# Altium project PuttPilot-Dev.PrjPcb (part 1 of 4)
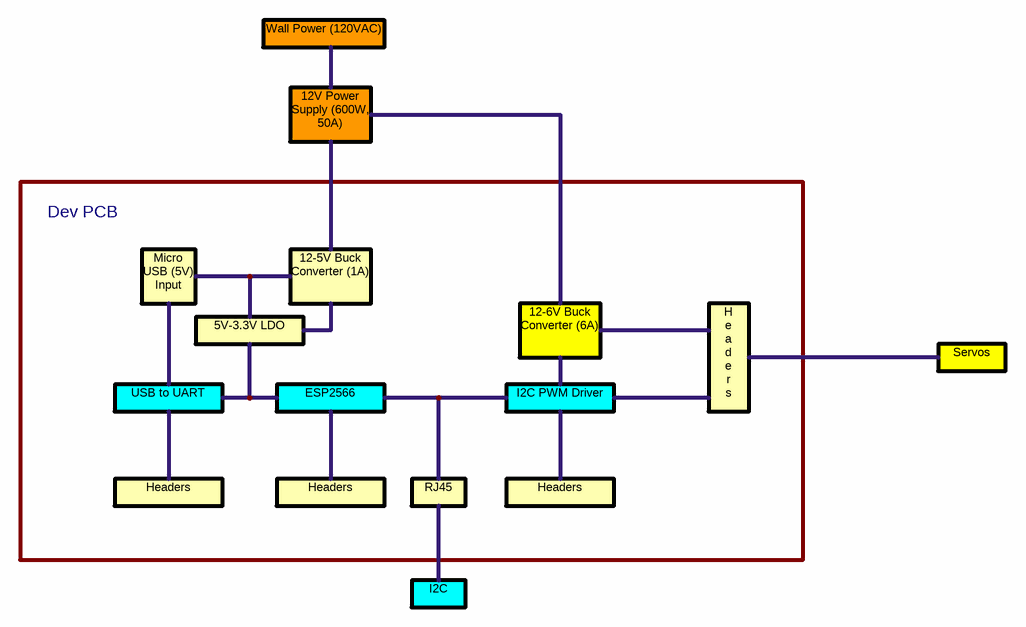
[diagram p0: Block-Diagram.SchDoc]
7 sheets, 253 parts. Net scope: hierarchical (ports join the sheet entries above them; power ports are global).
Board file: PuttPilot-Dev.PcbDoc
Sheets:
  Block-Diagram.SchDoc
  Hierarchal.SchDoc
    U_PWM_CONTROL = PWM_CONTROL.SchDoc
    U_ESP8266 = ESP8266.SchDoc
    U_ESP-Power = ESP-Power.SchDoc
    U_UART_TO_UART = USB_TO_UART.SchDoc
    B1 = Servo-Power.SchDoc
    B2 = Servo-Power.SchDoc
    B3 = Servo-Power.SchDoc

## Sheet Block-Diagram.SchDoc: Block Diagram
size 279 x 215 mm; DrawnBy: Ethan Abraham; Engineer: Ethan Abraham; Revision: 1.0; SheetNumber: 1; SheetTotal: 7

### Notes on the sheet
- Wall Power (120VAC)
- 12V Power Supply (600W, 50A)
- Dev PCB
- Micro USB (5V) Input
- 12-5V Buck Converter (1A)
- 5V-3.3V LDO
- 12-6V Buck Converter (6A)
- Servos
- USB to UART
- ESP2566
- I2C PWM Driver
- H
  e
  a
  d
  e
  r
  s
- Headers
- RJ45
- I2C
- PuttPilot
- 200 University Ave W
- PROJECT
- Waterloo, Ontario, Canada
- N2L 3G1
- REVISION
- DOCUMENT
- ENGINEER
- REVIEWER
- MODIFIED
- SHEET
- OF

## Sheet Hierarchal.SchDoc: Hierarchal Power
size 431 x 279 mm; DrawnBy: Ethan Abraham; Engineer: Ethan Abraham; SheetNumber: 2; SheetTotal: 7
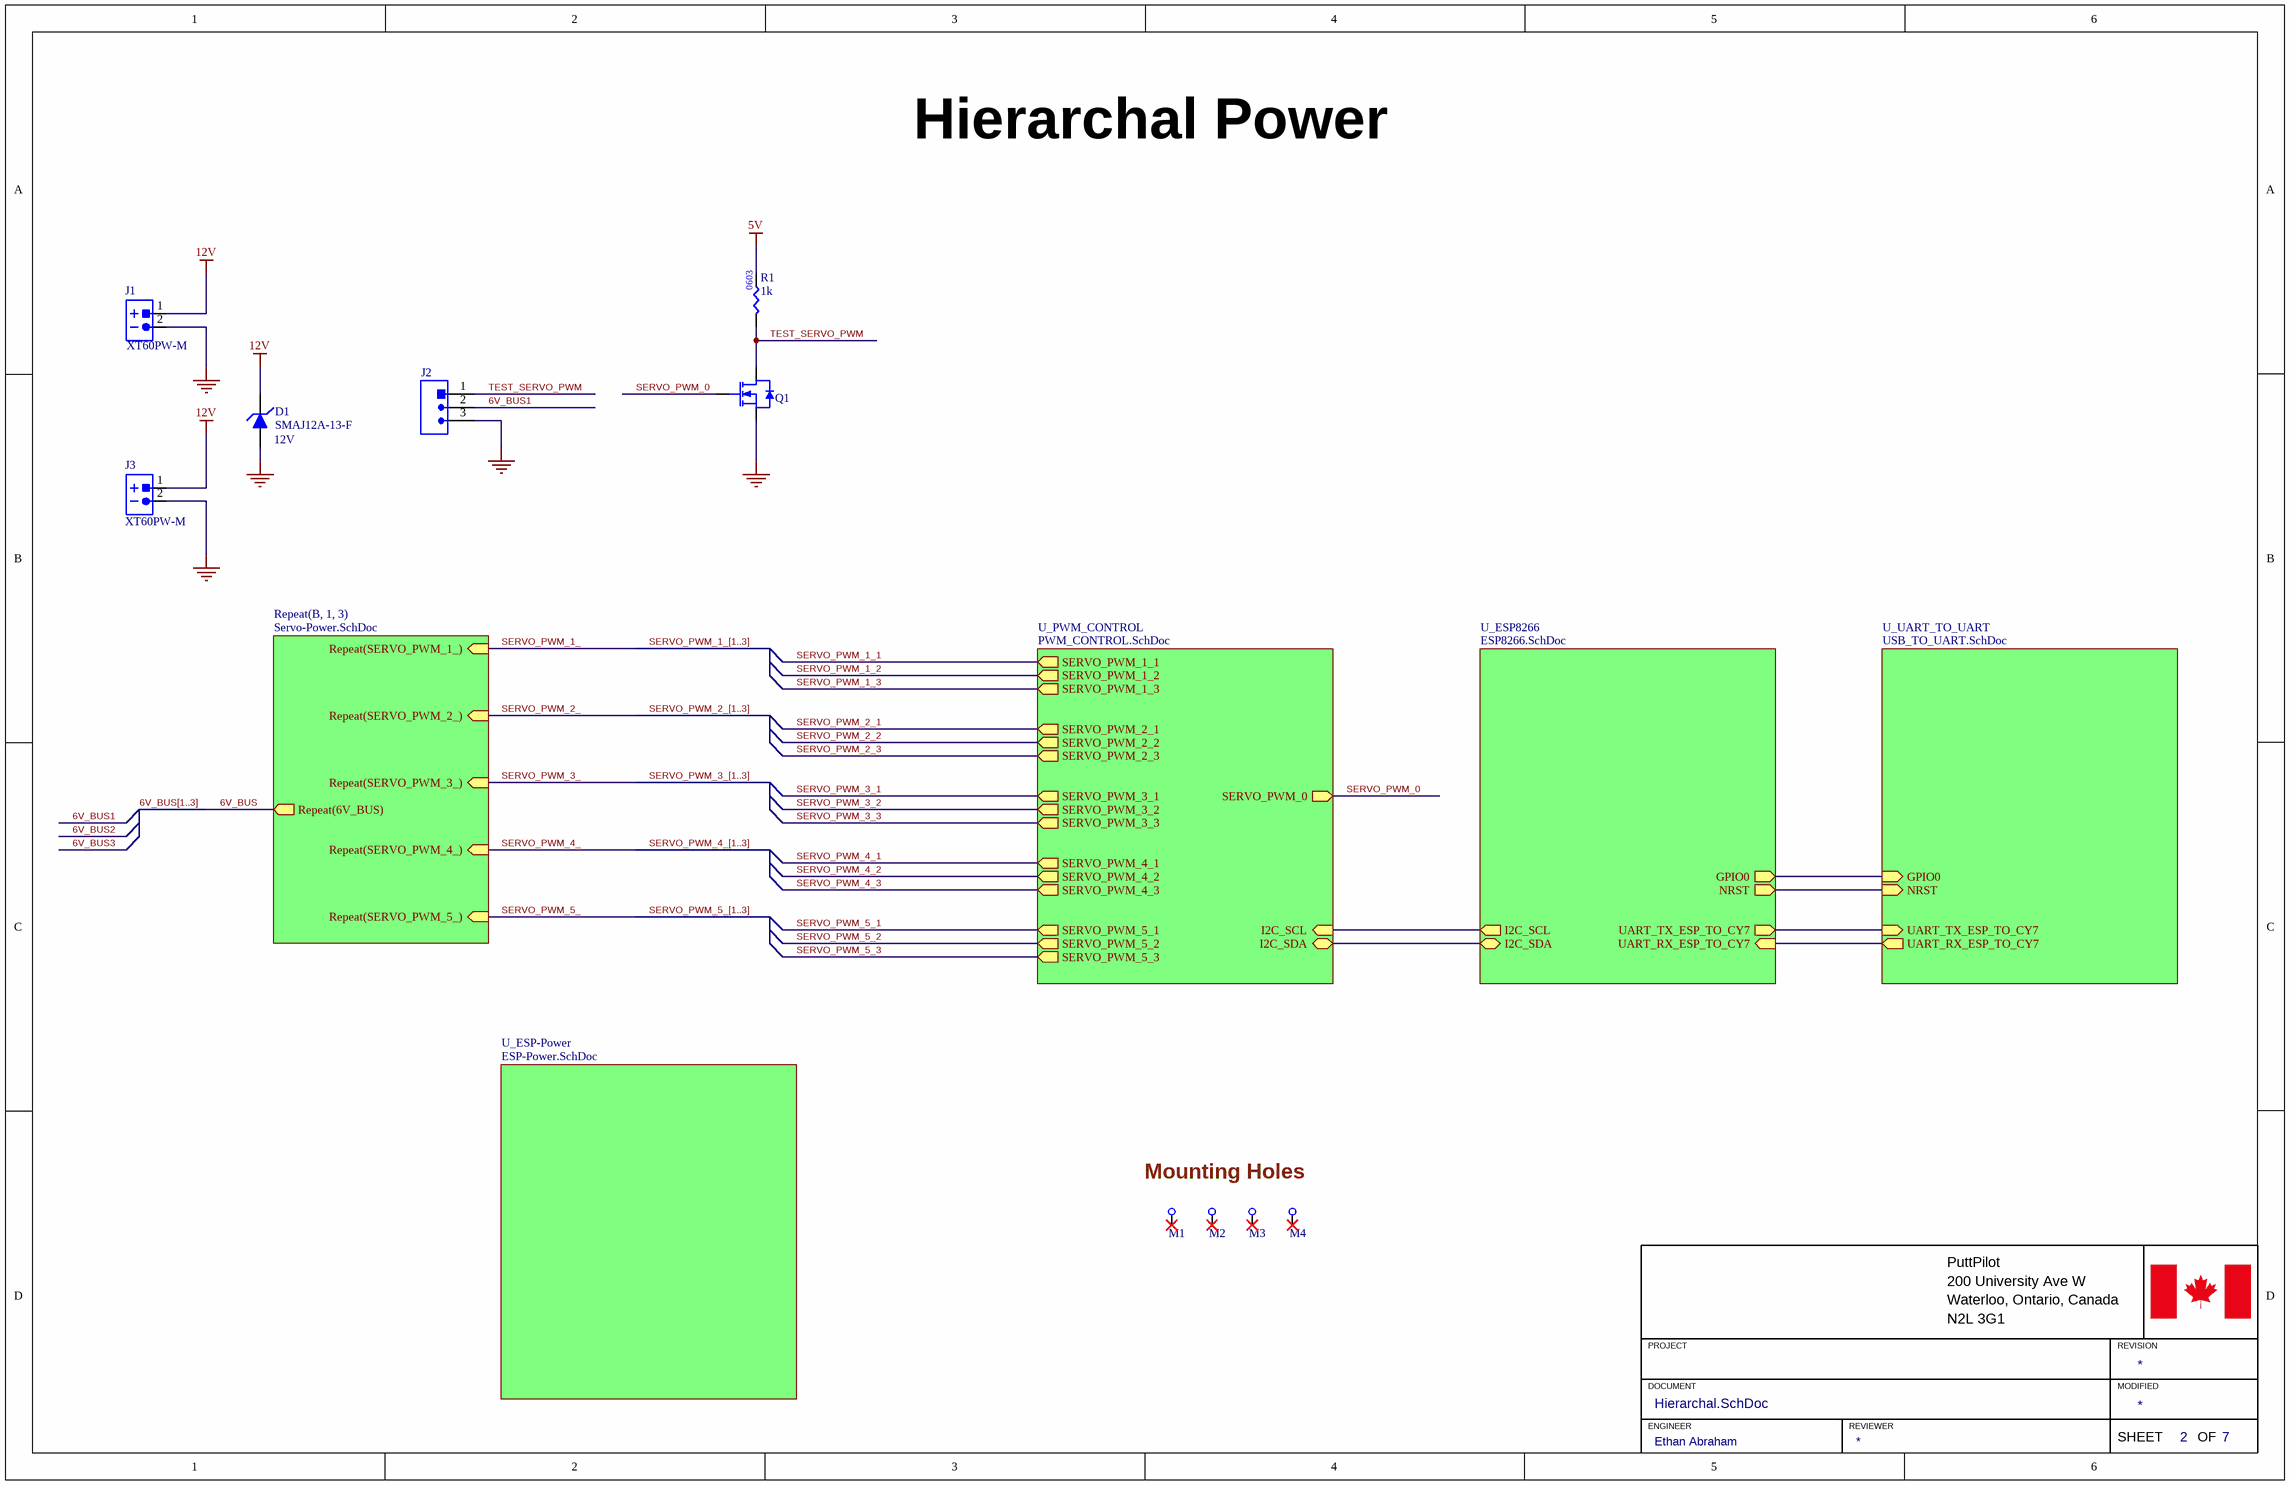
[diagram p1: Hierarchal.SchDoc]

### Parts
D1  SMAJ12A-13-F  Rep Pk Reverse Voltage-Max: 12V  [SMAJ12A-13-F]
J1  XT60PW-M  [XT60PW-M]
J2  TSW-101-08-G-T-RA  [HEADER_3POS_R/A_2.54MM]  (value not drawn)
J3  XT60PW-M  [XT60PW-M]
M1  .HOLE_M3  [.HOLE_M3]  (value not drawn)
M2  .HOLE_M3  [.HOLE_M3]  (value not drawn)
M3  .HOLE_M3  [.HOLE_M3]  (value not drawn)
M4  .HOLE_M3  [.HOLE_M3]  (value not drawn)
Q1  DMN6140L-7  [.SOT-23-3]  (value not drawn)
R1  Resistance: 1k  [.RES_0603]  (hidden comment: RC0603FR-071KL)

### Sub-sheets
Repeat(B, 1, 3) = Servo-Power.SchDoc: Repeat(6V_BUS) (out), Repeat(SERVO_PWM_1_) (in), Repeat(SERVO_PWM_2_) (in), Repeat(SERVO_PWM_3_) (in), Repeat(SERVO_PWM_4_) (in), Repeat(SERVO_PWM_5_) (in)
U_ESP8266 = ESP8266.SchDoc: I2C_SDA (bidir), I2C_SCL (out), UART_TX_ESP_TO_CY7 (out), UART_RX_ESP_TO_CY7 (in), GPIO0 (out), NRST (out)
U_ESP-Power = ESP-Power.SchDoc: no entries
U_PWM_CONTROL = PWM_CONTROL.SchDoc: SERVO_PWM_0 (out), I2C_SCL (in), I2C_SDA (bidir), SERVO_PWM_1_1 (out), SERVO_PWM_2_1 (out), SERVO_PWM_3_1 (out), SERVO_PWM_4_1 (out), SERVO_PWM_5_1 (out), SERVO_PWM_1_2 (out), SERVO_PWM_2_2 (out), SERVO_PWM_3_2 (out), SERVO_PWM_4_2 (out), SERVO_PWM_5_2 (out), SERVO_PWM_1_3 (out), SERVO_PWM_2_3 (out), SERVO_PWM_3_3 (out), SERVO_PWM_4_3 (out), SERVO_PWM_5_3 (out)
U_UART_TO_UART = USB_TO_UART.SchDoc: UART_RX_ESP_TO_CY7 (out), UART_TX_ESP_TO_CY7 (in), NRST (in), GPIO0 (in)

### Nets
5V: R1.2
12V: D1.2(Pin_2) J1.1 J3.1
GND: D1.1(Pin_1) J1.2 J2.3 J3.2 Q1.2(Source)
6V_BUS: sheet Repeat(B, 1, 3)/Repeat(6V_BUS)
6V_BUS1: J2.2  [project net 6V_BUS]
GPIO0: sheet U_ESP8266/GPIO0, sheet U_UART_TO_UART/GPIO0
I2C_SCL: sheet U_PWM_CONTROL/I2C_SCL, sheet U_ESP8266/I2C_SCL
I2C_SDA: sheet U_PWM_CONTROL/I2C_SDA, sheet U_ESP8266/I2C_SDA
NRST: sheet U_ESP8266/NRST, sheet U_UART_TO_UART/NRST
SERVO_PWM_0: Q1.1(Gate) ; sheet U_PWM_CONTROL/SERVO_PWM_0
SERVO_PWM_1_: sheet Repeat(B, 1, 3)/Repeat(SERVO_PWM_1_)
SERVO_PWM_2_: sheet Repeat(B, 1, 3)/Repeat(SERVO_PWM_2_)
SERVO_PWM_3_: sheet Repeat(B, 1, 3)/Repeat(SERVO_PWM_3_)
SERVO_PWM_4_: sheet Repeat(B, 1, 3)/Repeat(SERVO_PWM_4_)
SERVO_PWM_5_: sheet Repeat(B, 1, 3)/Repeat(SERVO_PWM_5_)
TEST_SERVO_PWM: J2.1 Q1.3(Drain) R1.1
UART_RX_ESP_TO_CY7: sheet U_ESP8266/UART_RX_ESP_TO_CY7, sheet U_UART_TO_UART/UART_RX_ESP_TO_CY7
UART_TX_ESP_TO_CY7: sheet U_ESP8266/UART_TX_ESP_TO_CY7, sheet U_UART_TO_UART/UART_TX_ESP_TO_CY7

Not connected (* = marked no-connect by the designer): M1 1*; M2 1*; M3 1*; M4 1*

### Buses and harness runs
bus 6V_BUS[1..3]
bus SERVO_PWM_1_[1..3]
bus SERVO_PWM_2_[1..3]
bus SERVO_PWM_3_[1..3]
bus SERVO_PWM_4_[1..3]
bus SERVO_PWM_5_[1..3]

### Notes on the sheet
- Mounting Holes
- PuttPilot
- 200 University Ave W
- Waterloo, Ontario, Canada
- PROJECT
- N2L 3G1
- REVISION
- DOCUMENT
- ENGINEER
- REVIEWER
- MODIFIED
- SHEET
- OF

### Library data of the parts
D1 = SMAJ12A-13-F: TVS DIODE 12VWM; Manufacturer: Diodes; Package Body Material: Plastic; Diode Element Material: SILICON; Diode Type: TRANS VOLTAGE SUPPRESSOR; Number of Elements: 1; Time @ Peak Reflow Temperature-Max (s): 40s; Polarity: Unidirectional; Additional Feature: EXCELLENT CLAMPING CAPABILITY; Max Breakdown Voltage: 14.7V; Min Breakdown Voltage: 13.3V; Breakdown Voltage-Nom: 14V; Clamping Voltage-Max: 19.9V; Non-rep Peak Rev Power Dis-Max: 400W; Max Power Dissipation: 1W; Qualification Status: Not Qualified; Supplier 1: Digikey; Manufacturer Part Number: SMAJ12A-13-F; RoHS: Yes; Category: TVS Diodes; Stock 1: 25706; Pricing 1: 1=0.29, 10=0.197, 100=0.1322, 500=0.1019, 1000=0.09178, 2000=0.08313 (USD); Number of Pins: 2; Package Shape: Rectangular; Terminal Finish: Tin; Min Operating Temperature: -55°C; Max Operating Temperature: 150°C; JESD-609 Code: e3; JESD-30 Code: R-PDSO-C2; Package Style: SMALL OUTLINEMeter; Surface Mount: Yes; Terminal Form: C BEND; Terminal Position: DUAL; Moisture Sensitivity Level: 1; Peak Reflow Temperature (Cel): 260°C; Technology: AVALANCHE; RoHS Compliant: Yes; Reach SVHC Compliant: No; ComponentLink1URL: https://datasheet.ciiva.com:443/pdfs/VipMasterIC/IC/DIOD/DIOD-S-A0009689838/DIOD-S-A0009691421-1.pdf?src-supplier=IHS+Markit; ComponentLink1Description: https://datasheet.ciiva.com:443/pdfs/VipMasterIC/IC/DIOD/DIOD-S-A0009689838/DIOD-S-A0009691421-1.pdf?src-supplier=IHS+Markit; ComponentLink2URL: https://datasheet.ciiva.com/15143/getdatasheetpartid-164236-15143864.pdf?src-supplier=Verical; ComponentLink2Description: https://datasheet.ciiva.com/15143/getdatasheetpartid-164236-15143864.pdf?src-supplier=Verical; Supplier Part Number 1: SMAJ12A-FDICT-ND
J1 J3 = XT60PW-M: XT60PW Male; Manufacturer: Unclassified; Manufacturer Part Number: XT60PW-M; Supplier Part Number 1: 1805375
J2 = TSW-101-08-G-T-RA: CONN HEADER R/A 3POS 2.54MM
M1-M4 = .HOLE_M3: .HOLE M3
Q1 = DMN6140L-7: MOSFET N-CH 60V 1.6A SOT-23; Manufacturer: Diodes; Rds On Max: 140mR; Input Capacitance: 315pF; Max Power Dissipation: 700mW; Threshold Voltage: 3V; Number of Channels: 1; Gate to Source Voltage (Vgs): 20V; Fall Time: 2.7ns; Rise Time: 3.6ns; Turn-Off Delay Time: 16.3ns; Turn-On Delay Time: 2.6ns; Polarity: N-CHANNEL; Supplier 1: Future Electronics; Manufacturer Part Number: DMN6140L-7; RoHS: Yes; Category: MOSFETs; Stock 1: 624000; Pricing 1: 3000=0.0489, 9000=0.047, 15000=0.0462, 45000=0.0445, 75000=0.043 (USD); Mount: Surface Mount; Case/Package: SOT-23; Number of Pins: 3; Weight: 0.000282oz; Min Operating Temperature: -55°C; Max Operating Temperature: 150°C; Package Quantity: 1; Packaging: Tape and Reel; Drain to Source Voltage (Vdss): 60V; Continuous Drain Current (ID): 1.6A; Drain to Source Resistance: 140mR; Series: -; Reach SVHC Compliant: No; Lead Free: Lead Free; RoHS Compliant: Yes; ComponentLink1URL: https://datasheet.ciiva.com/29747/dmn6140l-29747654.pdf?src-supplier=Digikey; ComponentLink1Description: https://datasheet.ciiva.com/29747/dmn6140l-29747654.pdf?src-supplier=Digikey; ComponentLink2URL: https://datasheet.ciiva.com/29747/dmn6140l-29747660.pdf?src-supplier=Digikey; ComponentLink2Description: https://datasheet.ciiva.com/29747/dmn6140l-29747660.pdf?src-supplier=Digikey; Supplier Part Number 1: 4046633
R1 = RC0603FR-071KL: RES 1K OHM 0603; Manufacturer: Yageo; Tolerance: 1%; Additional Feature: LASER TRIMMABLE; Rated Power Dissipation (P): 100mW; Rated Temperature: 70°C; Temperature Coefficient: 100ppm/°C; Working Voltage: 75V; Package Height: 0.45mm; Package Length: 1.6mm; Package Width: 0.8mm; Supplier 1: Future Electronics; Manufacturer Part Number: RC0603FR-071KL; RoHS: Yes; Category: Chip SMD Resistors; Stock 1: 12810000; Pricing 1: 5000=0.0026, 50000=0.0025, 150000=0.0024, 375000=0.0023, 1000000=0.0022 (USD); Mount: Surface Mount; Number of Pins: 2; Package Shape: Rectangular; Size Code: 0603; Terminal Finish: Nickel; Min Operating Temperature: -55°C; Max Operating Temperature: 155°C; JESD-609 Code: e3; Resistor Type: FIXED RESISTOR; Construction: Chip; Package Style: SMTMeter; Packaging: Tape and Reel; Technology: METAL GLAZE/THICK FILM; Termination: Wraparound; Reach SVHC Compliant: Yes; RoHS Compliant: Yes; ComponentLink1URL: https://datasheet.ciiva.com:443/pdfs/VipMasterIC/IC/YAGO/YAGO-S-A0008145938/YAGO-S-A0008145938-1.pdf?src-supplier=IHS+Markit; ComponentLink1Description: https://datasheet.ciiva.com:443/pdfs/VipMasterIC/IC/YAGO/YAGO-S-A0008145938/YAGO-S-A0008145938-1.pdf?src-supplier=IHS+Markit; ComponentLink2URL: https://datasheet.ciiva.com/11808/0900766b80f96399-11808081.pdf?src-supplier=Rs; ComponentLink2Description: https://datasheet.ciiva.com/11808/0900766b80f96399-11808081.pdf?src-supplier=Rs; ComponentLink3URL: https://datasheet.ciiva.com/8896/pyu-rc0603-51-rohs-l-4-8896106.pdf?src-supplier=Avnet; ComponentLink3Description: https://datasheet.ciiva.com/8896/pyu-rc0603-51-rohs-l-4-8896106.pdf?src-supplier=Avnet; ComponentLink4URL: https://datasheet.ciiva.com/7660/1868787-7660790.pdf?src-supplier=Element14; ComponentLink4Description: https://datasheet.ciiva.com/7660/1868787-7660790.pdf?src-supplier=Element14; ComponentLink5URL: https://datasheet.ciiva.com/7746/1738695-7746279.pdf?src-supplier=Element14; ComponentLink5Description: https://datasheet.ciiva.com/7746/1738695-7746279.pdf?src-supplier=Element14; ComponentLink6URL: https://datasheet.ciiva.com/7746/1686128-7746280.pdf?src-supplier=Element14; ComponentLink6Description: https://datasheet.ciiva.com/7746/1686128-7746280.pdf?src-supplier=Element14; ComponentLink7URL: https://datasheet.ciiva.com/7746/1738695-7746281.pdf?src-supplier=Element14; ComponentLink7Description: https://datasheet.ciiva.com/7746/1738695-7746281.pdf?src-supplier=Element14; ComponentLink8URL: https://datasheet.ciiva.com/7983/443971-7983613.pdf?src-supplier=Element14; ComponentLink8Description: https://datasheet.ciiva.com/7983/443971-7983613.pdf?src-supplier=Element14; ComponentLink9URL: https://datasheet.ciiva.com/15189/getdatasheetpartid-404327-15189644.pdf?src-supplier=Verical; ComponentLink9Description: https://datasheet.ciiva.com/15189/getdatasheetpartid-404327-15189644.pdf?src-supplier=Verical; Supplier Part Number 1: 4016291

## Sheet PWM_CONTROL.SchDoc: PWM Control
size 279 x 215 mm; DrawnBy: Ethan Abraham; Engineer: Ethan Abraham; Revision: 1.0; SheetNumber: 7; SheetTotal: 7
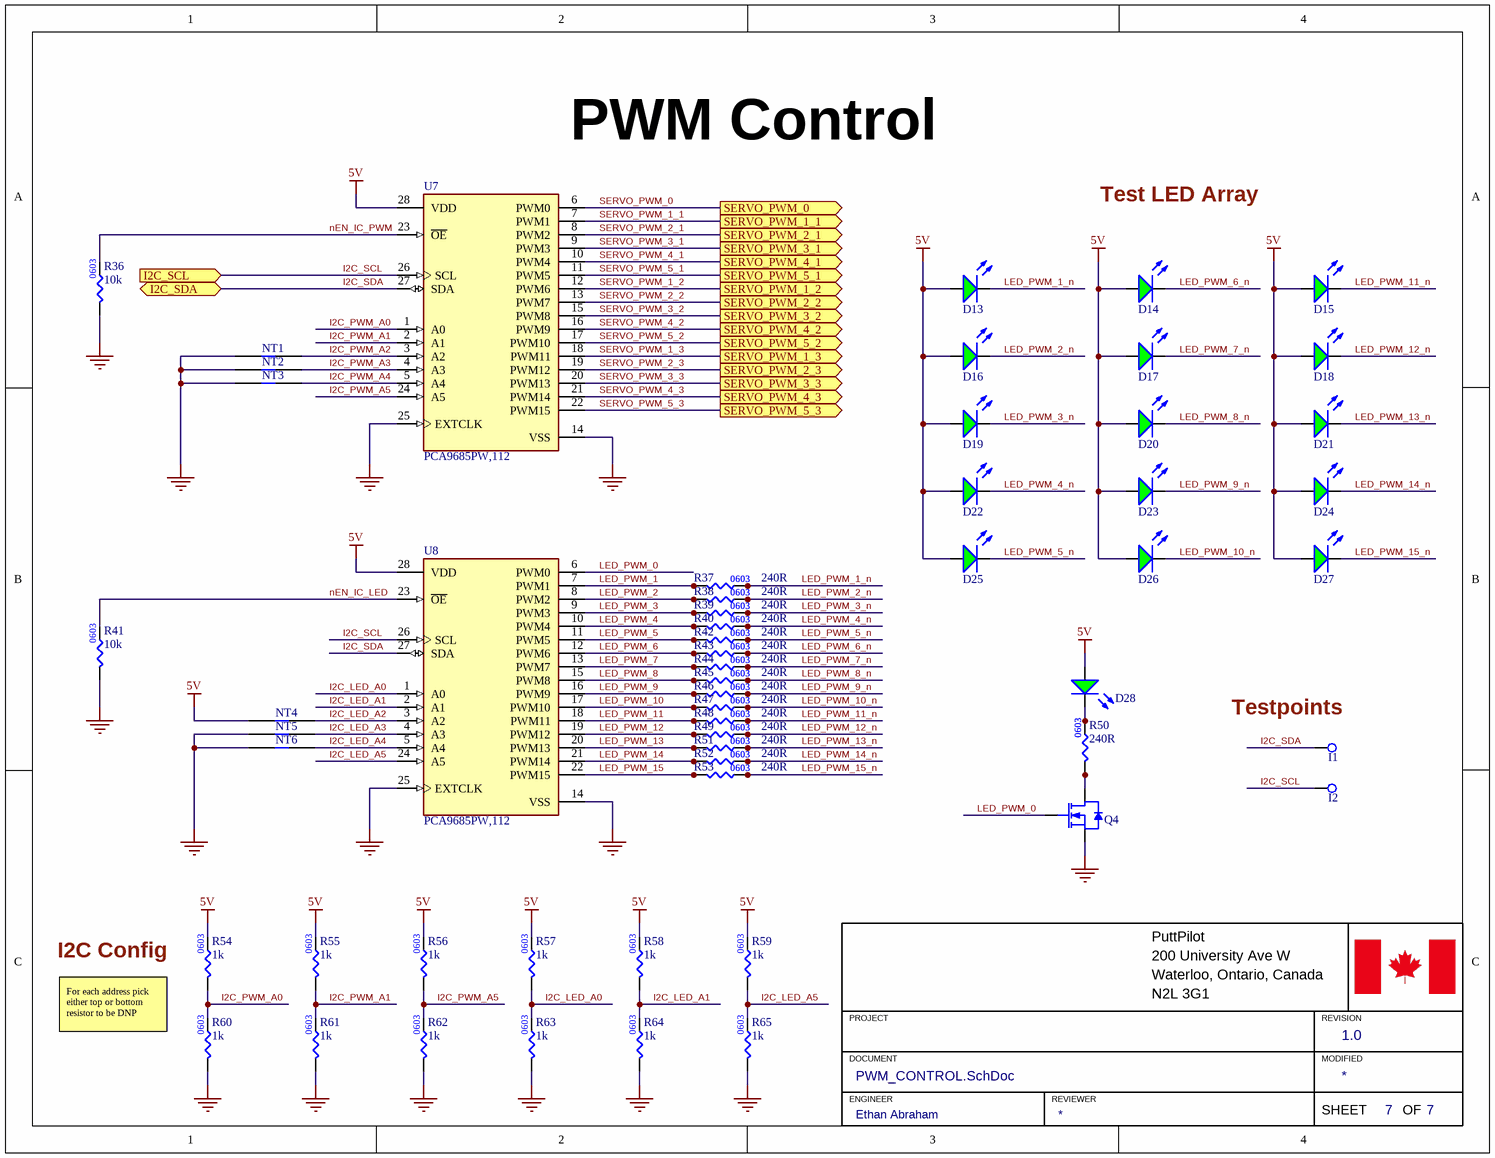
[diagram p2: PWM_CONTROL.SchDoc]

### Parts
D13  LTST-C191KGKT  [.LED_0603]  (value not drawn)
D14  LTST-C191KGKT  [.LED_0603]  (value not drawn)
D15  LTST-C191KGKT  [.LED_0603]  (value not drawn)
D16  LTST-C191KGKT  [.LED_0603]  (value not drawn)
D17  LTST-C191KGKT  [.LED_0603]  (value not drawn)
D18  LTST-C191KGKT  [.LED_0603]  (value not drawn)
D19  LTST-C191KGKT  [.LED_0603]  (value not drawn)
D20  LTST-C191KGKT  [.LED_0603]  (value not drawn)
D21  LTST-C191KGKT  [.LED_0603]  (value not drawn)
D22  LTST-C191KGKT  [.LED_0603]  (value not drawn)
D23  LTST-C191KGKT  [.LED_0603]  (value not drawn)
D24  LTST-C191KGKT  [.LED_0603]  (value not drawn)
D25  LTST-C191KGKT  [.LED_0603]  (value not drawn)
D26  LTST-C191KGKT  [.LED_0603]  (value not drawn)
D27  LTST-C191KGKT  [.LED_0603]  (value not drawn)
D28  LTST-C191KGKT  [.LED_0603]  (value not drawn)
I1  RCWCTE  [RCWCTE]  (value not drawn)
I2  RCWCTE  [RCWCTE]  (value not drawn)
NT1  .NET_TIE  [.NET_TIE]  (value not drawn)
NT2  .NET_TIE  [.NET_TIE]  (value not drawn)
NT3  .NET_TIE  [.NET_TIE]  (value not drawn)
NT4  .NET_TIE  [.NET_TIE]  (value not drawn)
NT5  .NET_TIE  [.NET_TIE]  (value not drawn)
NT6  .NET_TIE  [.NET_TIE]  (value not drawn)
Q4  DMN6140L-7  [.SOT-23-3]  (value not drawn)
R36  Resistance: 10k  [.RES_0603]  (hidden comment: RC0603FR-0710KL)
R37  Resistance: 240R  [.RES_0603]  (hidden comment: RC0603FR-07240RL)
R38  Resistance: 240R  [.RES_0603]  (hidden comment: RC0603FR-07240RL)
R39  Resistance: 240R  [.RES_0603]  (hidden comment: RC0603FR-07240RL)
R40  Resistance: 240R  [.RES_0603]  (hidden comment: RC0603FR-07240RL)
R41  Resistance: 10k  [.RES_0603]  (hidden comment: RC0603FR-0710KL)
R42  Resistance: 240R  [.RES_0603]  (hidden comment: RC0603FR-07240RL)
R43  Resistance: 240R  [.RES_0603]  (hidden comment: RC0603FR-07240RL)
R44  Resistance: 240R  [.RES_0603]  (hidden comment: RC0603FR-07240RL)
R45  Resistance: 240R  [.RES_0603]  (hidden comment: RC0603FR-07240RL)
R46  Resistance: 240R  [.RES_0603]  (hidden comment: RC0603FR-07240RL)
R47  Resistance: 240R  [.RES_0603]  (hidden comment: RC0603FR-07240RL)
R48  Resistance: 240R  [.RES_0603]  (hidden comment: RC0603FR-07240RL)
R49  Resistance: 240R  [.RES_0603]  (hidden comment: RC0603FR-07240RL)
R50  Resistance: 240R  [.RES_0603]  (hidden comment: RC0603FR-07240RL)
R51  Resistance: 240R  [.RES_0603]  (hidden comment: RC0603FR-07240RL)
R52  Resistance: 240R  [.RES_0603]  (hidden comment: RC0603FR-07240RL)
R53  Resistance: 240R  [.RES_0603]  (hidden comment: RC0603FR-07240RL)
R54  Resistance: 1k  [.RES_0603]  (hidden comment: RC0603FR-071KL)
R55  Resistance: 1k  [.RES_0603]  (hidden comment: RC0603FR-071KL)
R56  Resistance: 1k  [.RES_0603]  (hidden comment: RC0603FR-071KL)
R57  Resistance: 1k  [.RES_0603]  (hidden comment: RC0603FR-071KL)
R58  Resistance: 1k  [.RES_0603]  (hidden comment: RC0603FR-071KL)
R59  Resistance: 1k  [.RES_0603]  (hidden comment: RC0603FR-071KL)
R60  Resistance: 1k  [.RES_0603]  (hidden comment: RC0603FR-071KL)
R61  Resistance: 1k  [.RES_0603]  (hidden comment: RC0603FR-071KL)
R62  Resistance: 1k  [.RES_0603]  (hidden comment: RC0603FR-071KL)
R63  Resistance: 1k  [.RES_0603]  (hidden comment: RC0603FR-071KL)
R64  Resistance: 1k  [.RES_0603]  (hidden comment: RC0603FR-071KL)
R65  Resistance: 1k  [.RES_0603]  (hidden comment: RC0603FR-071KL)
U7  PCA9685PW,112  [PCA9685PW,112]
U8  PCA9685PW,112  [PCA9685PW,112]

### Ports
I2C_SCL (in), I2C_SDA (bidir), SERVO_PWM_0 (out), SERVO_PWM_1_1 (out), SERVO_PWM_1_2 (out), SERVO_PWM_1_3 (out), SERVO_PWM_2_1 (out), SERVO_PWM_2_2 (out), SERVO_PWM_2_3 (out), SERVO_PWM_3_1 (out), SERVO_PWM_3_2 (out), SERVO_PWM_3_3 (out), SERVO_PWM_4_1 (out), SERVO_PWM_4_2 (out), SERVO_PWM_4_3 (out), SERVO_PWM_5_1 (out), SERVO_PWM_5_2 (out), SERVO_PWM_5_3 (out)

### Nets
5V: D13.1(A) D14.1(A) D15.1(A) D16.1(A) D17.1(A) D18.1(A) D19.1(A) D20.1(A) D21.1(A) D22.1(A) D23.1(A) D24.1(A) D25.1(A) D26.1(A) D27.1(A) D28.1(A) NT4.1 R54.2 R55.2 R56.2 R57.2 R58.2 R59.2 U7.28(VDD) U8.28(VDD)
GND: NT1.1 NT2.1 NT3.1 NT5.1 NT6.1 Q4.2(Source) R36.1 R41.1 R60.1 R61.1 R62.1 R63.1 R64.1 R65.1 U7.14(VSS) U7.25(EXTCLK) U8.14(VSS) U8.25(EXTCLK)
I2C_LED_A0: R57.1 R63.2 U8.1(A0)
I2C_LED_A1: R58.1 R64.2 U8.2(A1)
I2C_LED_A2: NT4.2 U8.3(A2)
I2C_LED_A3: NT5.2 U8.4(A3)
I2C_LED_A4: NT6.2 U8.5(A4)
I2C_LED_A5: R59.1 R65.2 U8.24(A5)
I2C_PWM_A0: R54.1 R60.2 U7.1(A0)
I2C_PWM_A1: R55.1 R61.2 U7.2(A1)
I2C_PWM_A2: NT1.2 U7.3(A2)
I2C_PWM_A3: NT2.2 U7.4(A3)
I2C_PWM_A4: NT3.2 U7.5(A4)
I2C_PWM_A5: R56.1 R62.2 U7.24(A5)
I2C_SCL: I2.1 U7.26(SCL) U8.26(SCL) ; port I2C_SCL
I2C_SDA: I1.1 U7.27(SDA) U8.27(SDA) ; port I2C_SDA
LED_PWM_0: Q4.1(Gate) U8.6(PWM0)
LED_PWM_1: R37.1 U8.7(PWM1)
LED_PWM_1_n: D13.2(K) R37.2
LED_PWM_2: R38.1 U8.8(PWM2)
LED_PWM_2_n: D16.2(K) R38.2
LED_PWM_3: R39.1 U8.9(PWM3)
LED_PWM_3_n: D19.2(K) R39.2
LED_PWM_4: R40.1 U8.10(PWM4)
LED_PWM_4_n: D22.2(K) R40.2
LED_PWM_5: R42.1 U8.11(PWM5)
LED_PWM_5_n: D25.2(K) R42.2
LED_PWM_6: R43.1 U8.12(PWM6)
LED_PWM_6_n: D14.2(K) R43.2
LED_PWM_7: R44.1 U8.13(PWM7)
LED_PWM_7_n: D17.2(K) R44.2
LED_PWM_8: R45.1 U8.15(PWM8)
LED_PWM_8_n: D20.2(K) R45.2
LED_PWM_9: R46.1 U8.16(PWM9)
LED_PWM_9_n: D23.2(K) R46.2
LED_PWM_10: R47.1 U8.17(PWM10)
LED_PWM_10_n: D26.2(K) R47.2
LED_PWM_11: R48.1 U8.18(PWM11)
LED_PWM_11_n: D15.2(K) R48.2
LED_PWM_12: R49.1 U8.19(PWM12)
LED_PWM_12_n: D18.2(K) R49.2
LED_PWM_13: R51.1 U8.20(PWM13)
LED_PWM_13_n: D21.2(K) R51.2
LED_PWM_14: R52.1 U8.21(PWM14)
LED_PWM_14_n: D24.2(K) R52.2
LED_PWM_15: R53.1 U8.22(PWM15)
LED_PWM_15_n: D27.2(K) R53.2
nEN_IC_LED: R41.2 U8.23(~{OE})
nEN_IC_PWM: R36.2 U7.23(~{OE})
SERVO_PWM_0: U7.6(PWM0) ; port SERVO_PWM_0
SERVO_PWM_1_1: U7.7(PWM1) ; port SERVO_PWM_1_1  [project net SERVO_PWM_1_]
SERVO_PWM_1_2: U7.12(PWM6) ; port SERVO_PWM_1_2  [project net SERVO_PWM_1_]
SERVO_PWM_1_3: U7.18(PWM11) ; port SERVO_PWM_1_3  [project net SERVO_PWM_1_]
SERVO_PWM_2_1: U7.8(PWM2) ; port SERVO_PWM_2_1  [project net SERVO_PWM_2_]
SERVO_PWM_2_2: U7.13(PWM7) ; port SERVO_PWM_2_2  [project net SERVO_PWM_2_]
SERVO_PWM_2_3: U7.19(PWM12) ; port SERVO_PWM_2_3  [project net SERVO_PWM_2_]
SERVO_PWM_3_1: U7.9(PWM3) ; port SERVO_PWM_3_1  [project net SERVO_PWM_3_]
SERVO_PWM_3_2: U7.15(PWM8) ; port SERVO_PWM_3_2  [project net SERVO_PWM_3_]
SERVO_PWM_3_3: U7.20(PWM13) ; port SERVO_PWM_3_3  [project net SERVO_PWM_3_]
SERVO_PWM_4_1: U7.10(PWM4) ; port SERVO_PWM_4_1  [project net SERVO_PWM_4_]
SERVO_PWM_4_2: U7.16(PWM9) ; port SERVO_PWM_4_2  [project net SERVO_PWM_4_]
SERVO_PWM_4_3: U7.21(PWM14) ; port SERVO_PWM_4_3  [project net SERVO_PWM_4_]
SERVO_PWM_5_1: U7.11(PWM5) ; port SERVO_PWM_5_1  [project net SERVO_PWM_5_]
SERVO_PWM_5_2: U7.17(PWM10) ; port SERVO_PWM_5_2  [project net SERVO_PWM_5_]
SERVO_PWM_5_3: U7.22(PWM15) ; port SERVO_PWM_5_3  [project net SERVO_PWM_5_]
NetD28_2: D28.2(K) R50.2
NetQ4_3: Q4.3(Drain) R50.1

### Notes on the sheet
- Test LED Array
- (near I1) Testpoints
- (near R54) I2C Config
- For each address pick either top or bottom resistor to be DNP
- PuttPilot
- 200 University Ave W
- PROJECT
- Waterloo, Ontario, Canada
- N2L 3G1
- REVISION
- DOCUMENT
- ENGINEER
- REVIEWER
- MODIFIED
- SHEET
- OF

### Library data of the parts
D13-D28 = LTST-C191KGKT: LED GREEN 2V 0603; Manufacturer: Vishay Lite-On; Shape: Rectangular; Lens Style: WATER CLEAR; Forward Current-Max: 30mA; Luminous Intensity-Nom: 35mcd; Number of Functions: 1; Optoelectronic Device Type: SINGLE COLOR LED; Viewing Angle: 130°; Forward Voltage-Max: 2.4V; Reverse Voltage-Max: 5V; Overall Height: 0.55mm; Supplier 1: Digikey; Manufacturer Part Number: LTST-C191KGKT; RoHS: Yes; Stock 1: 171853; Pricing 1: 1=0.22, 10=0.121, 100=0.0721, 500=0.05324, 1000=0.04748, 2000=0.04278 (USD); Mount: Surface Mount; Number of Pins: 2; Color: Green; Color@wavelength: Green; Terminal Finish: Tin; Min Operating Temperature: -55°C; Max Operating Temperature: 85°C; Packaging: Tape and Reel; JESD-609 Code: e3; Size: 1.1mm; Terminal Pitch: 1.5mm; Reach SVHC Compliant: Yes; RoHS Compliant: Yes; ComponentLink1URL: https://datasheet.ciiva.com:443/pdfs/VipMasterIC/IC/LITE/LITE-S-A0003156116/LITE-S-A0003156116-1.pdf?src-supplier=IHS+Markit; ComponentLink1Description: https://datasheet.ciiva.com:443/pdfs/VipMasterIC/IC/LITE/LITE-S-A0003156116/LITE-S-A0003156116-1.pdf?src-supplier=IHS+Markit; ComponentLink2URL: https://datasheet.ciiva.com/2109/ltst-c191kgkt-2109973.pdf?src-supplier=Digikey; ComponentLink2Description: https://datasheet.ciiva.com/2109/ltst-c191kgkt-2109973.pdf?src-supplier=Digikey; Supplier Part Number 1: 160-1446-1-ND
I1 I2 = RCWCTE: SMT Test Point; Manufacturer: KOA Speer; Resistance: 0R; Current Rating: 2A; Number of Contacts: 1; Supplier 1: Digikey; Manufacturer Part Number: RCWCTE; RoHS: Yes; Category: Chip SMD Resistors; Stock 1: 56953; Pricing 1: 1=0.2, 10=0.15, 25=0.1344, 50=0.1238, 100=0.1141, 250=0.10268, 500=0.09488, 1000=0.08781 (USD); Mount: Surface Mount; Case/Package: 1206; Case Code (Imperial): 1206; Case Code (Metric): 3216; Contact Material: Copper,Tin; Min Operating Temperature: -55°C; Max Operating Temperature: 125°C; Packaging: Tape and Reel; Termination: SMD/SMT; Series: RC; Length: 3.2mm; Width: 1.6mm; Height: 2mm; Depth: 1.6mm; Military Standard: Not; RoHS Compliant: Yes; ComponentLink1URL: https://datasheet.ciiva.com/34302/1876186-34302940.pdf?src-supplier=Jameco; ComponentLink1Description: https://datasheet.ciiva.com/34302/1876186-34302940.pdf?src-supplier=Jameco; ComponentLink2URL: https://datasheet.ciiva.com/5556/rc-5556236.pdf?src-supplier=Mouser; ComponentLink2Description: https://datasheet.ciiva.com/5556/rc-5556236.pdf?src-supplier=Mouser; ComponentLink3URL: https://datasheet.ciiva.com/26821/getdatasheetpartid-110197-26821157.pdf?src-supplier=Verical; ComponentLink3Description: https://datasheet.ciiva.com/26821/getdatasheetpartid-110197-26821157.pdf?src-supplier=Verical; Supplier Part Number 1: 2019-RCWCTECT-ND
NT1-NT6 = .NET_TIE: .GENERIC NET TIE
Q4 = DMN6140L-7: as Q1 on sheet Hierarchal; Supplier 1: Future Electronics; Manufacturer Part Number: DMN6140L-7; RoHS: Yes; Category: MOSFETs; Stock 1: 624000; Pricing 1: 3000=0.0489, 9000=0.047, 15000=0.0462, 45000=0.0445, 75000=0.043 (USD); Mount: Surface Mount; Case/Package: SOT-23; Number of Pins: 3; Weight: 0.000282oz; Min Operating Temperature: -55°C; Max Operating Temperature: 150°C; Package Quantity: 1; Packaging: Tape and Reel; Drain to Source Voltage (Vdss): 60V; Continuous Drain Current (ID): 1.6A; Drain to Source Resistance: 140mR; Series: -; Reach SVHC Compliant: No; Lead Free: Lead Free; RoHS Compliant: Yes; ComponentLink1URL: https://datasheet.ciiva.com/29747/dmn6140l-29747654.pdf?src-supplier=Digikey; ComponentLink1Description: https://datasheet.ciiva.com/29747/dmn6140l-29747654.pdf?src-supplier=Digikey; ComponentLink2URL: https://datasheet.ciiva.com/29747/dmn6140l-29747660.pdf?src-supplier=Digikey; ComponentLink2Description: https://datasheet.ciiva.com/29747/dmn6140l-29747660.pdf?src-supplier=Digikey; Supplier Part Number 1: 4046633
R36 R41 = RC0603FR-0710KL: RES 10K OHM 0603; Manufacturer: Yageo; Tolerance: 1%; Additional Feature: LASER TRIMMABLE; Rated Power Dissipation (P): 100mW; Rated Temperature: 70°C; Temperature Coefficient: 100ppm/°C; Working Voltage: 75V; Package Height: 0.45mm; Package Length: 1.6mm; Package Width: 0.8mm; Supplier 1: Future Electronics; Manufacturer Part Number: RC0603FR-0710KL; RoHS: Yes; Category: Chip SMD Resistors; Stock 1: 30355000; Pricing 1: 5000=0.0026, 50000=0.0025, 150000=0.0024, 375000=0.0023, 1000000=0.0022 (USD); Mount: Surface Mount; Number of Pins: 2; Package Shape: Rectangular; Size Code: 0603; Terminal Finish: Nickel; Min Operating Temperature: -55°C; Max Operating Temperature: 155°C; JESD-609 Code: e3; Resistor Type: FIXED RESISTOR; Construction: Chip; Package Style: SMTMeter; Packaging: Tape and Reel; Technology: METAL GLAZE/THICK FILM; Termination: Wraparound; Reach SVHC Compliant: Yes; RoHS Compliant: Yes; ComponentLink1URL: https://datasheet.ciiva.com:443/pdfs/VipMasterIC/IC/YAGO/YAGO-S-A0008145938/YAGO-S-A0008145938-1.pdf?src-supplier=IHS+Markit; ComponentLink1Description: https://datasheet.ciiva.com:443/pdfs/VipMasterIC/IC/YAGO/YAGO-S-A0008145938/YAGO-S-A0008145938-1.pdf?src-supplier=IHS+Markit; ComponentLink2URL: https://datasheet.ciiva.com/22747/443971-22747519.pdf?src-supplier=Element14; ComponentLink2Description: https://datasheet.ciiva.com/22747/443971-22747519.pdf?src-supplier=Element14; ComponentLink3URL: https://datasheet.ciiva.com/46440/1868787-46440891.pdf?src-supplier=Element14; ComponentLink3Description: https://datasheet.ciiva.com/46440/1868787-46440891.pdf?src-supplier=Element14; ComponentLink4URL: https://datasheet.ciiva.com/15189/getdatasheetpartid-409289-15189591.pdf?src-supplier=Verical; ComponentLink4Description: https://datasheet.ciiva.com/15189/getdatasheetpartid-409289-15189591.pdf?src-supplier=Verical; ComponentLink5URL: https://datasheet.ciiva.com/7660/38590-7660789.pdf?src-supplier=Element14; ComponentLink5Description: https://datasheet.ciiva.com/7660/38590-7660789.pdf?src-supplier=Element14; ComponentLink6URL: https://datasheet.ciiva.com/7746/1738695-7746239.pdf?src-supplier=Element14; ComponentLink6Description: https://datasheet.ciiva.com/7746/1738695-7746239.pdf?src-supplier=Element14; ComponentLink7URL: https://datasheet.ciiva.com/7983/443971-7983596.pdf?src-supplier=Element14; ComponentLink7Description: https://datasheet.ciiva.com/7983/443971-7983596.pdf?src-supplier=Element14; Supplier Part Number 1: 4023214
R37-R40 R42-R53 = RC0603FR-07240RL: RES 240 OHM 0603; Manufacturer: Yageo; Tolerance: 1%; Additional Feature: LASER TRIMMABLE; Rated Power Dissipation (P): 100mW; Rated Temperature: 70°C; Temperature Coefficient: 100ppm/°C; Working Voltage: 75V; Package Height: 0.45mm; Package Length: 1.6mm; Package Width: 0.8mm; Supplier 1: Future Electronics; Manufacturer Part Number: RC0603FR-07240RL; RoHS: Yes; Category: Chip SMD Resistors; Stock 1: 1760000; Pricing 1: 5000=0.0026, 50000=0.0025, 150000=0.0024, 375000=0.0023, 1000000=0.0022 (USD); Mount: Surface Mount; Number of Pins: 2; Package Shape: Rectangular; Size Code: 0603; Terminal Finish: Nickel; Min Operating Temperature: -55°C; Max Operating Temperature: 155°C; JESD-609 Code: e3; Resistor Type: FIXED RESISTOR; Construction: Chip; Package Style: SMTMeter; Packaging: Tape and Reel; Technology: METAL GLAZE/THICK FILM; Termination: Wraparound; Reach SVHC Compliant: Yes; RoHS Compliant: Yes; ComponentLink1URL: https://datasheet.ciiva.com:443/pdfs/VipMasterIC/IC/YAGO/YAGO-S-A0008145938/YAGO-S-A0008145938-1.pdf?src-supplier=IHS+Markit; ComponentLink1Description: https://datasheet.ciiva.com:443/pdfs/VipMasterIC/IC/YAGO/YAGO-S-A0008145938/YAGO-S-A0008145938-1.pdf?src-supplier=IHS+Markit; ComponentLink2URL: https://datasheet.ciiva.com/2508/pyu-r-int-thick-7-2508497.pdf?src-supplier=Digikey; ComponentLink2Description: https://datasheet.ciiva.com/2508/pyu-r-int-thick-7-2508497.pdf?src-supplier=Digikey; ComponentLink3URL: https://datasheet.ciiva.com/2508/pyu-r-int-thick-7-2508498.pdf?src-supplier=Digikey; ComponentLink3Description: https://datasheet.ciiva.com/2508/pyu-r-int-thick-7-2508498.pdf?src-supplier=Digikey; ComponentLink4URL: https://datasheet.ciiva.com/2508/pyu-r-int-thick-7-2508499.pdf?src-supplier=Digikey; ComponentLink4Description: https://datasheet.ciiva.com/2508/pyu-r-int-thick-7-2508499.pdf?src-supplier=Digikey; Supplier Part Number 1: 5308184
R54-R65 = RC0603FR-071KL: as R1 on sheet Hierarchal; Supplier 1: Future Electronics; Manufacturer Part Number: RC0603FR-071KL; RoHS: Yes; Category: Chip SMD Resistors; Stock 1: 12810000; Pricing 1: 5000=0.0026, 50000=0.0025, 150000=0.0024, 375000=0.0023, 1000000=0.0022 (USD); Mount: Surface Mount; Number of Pins: 2; Package Shape: Rectangular; Size Code: 0603; Terminal Finish: Nickel; Min Operating Temperature: -55°C; Max Operating Temperature: 155°C; JESD-609 Code: e3; Resistor Type: FIXED RESISTOR; Construction: Chip; Package Style: SMTMeter; Packaging: Tape and Reel; Technology: METAL GLAZE/THICK FILM; Termination: Wraparound; Reach SVHC Compliant: Yes; RoHS Compliant: Yes; ComponentLink1URL: https://datasheet.ciiva.com:443/pdfs/VipMasterIC/IC/YAGO/YAGO-S-A0008145938/YAGO-S-A0008145938-1.pdf?src-supplier=IHS+Markit; ComponentLink1Description: https://datasheet.ciiva.com:443/pdfs/VipMasterIC/IC/YAGO/YAGO-S-A0008145938/YAGO-S-A0008145938-1.pdf?src-supplier=IHS+Markit; ComponentLink2URL: https://datasheet.ciiva.com/11808/0900766b80f96399-11808081.pdf?src-supplier=Rs; ComponentLink2Description: https://datasheet.ciiva.com/11808/0900766b80f96399-11808081.pdf?src-supplier=Rs; ComponentLink3URL: https://datasheet.ciiva.com/8896/pyu-rc0603-51-rohs-l-4-8896106.pdf?src-supplier=Avnet; ComponentLink3Description: https://datasheet.ciiva.com/8896/pyu-rc0603-51-rohs-l-4-8896106.pdf?src-supplier=Avnet; ComponentLink4URL: https://datasheet.ciiva.com/7660/1868787-7660790.pdf?src-supplier=Element14; ComponentLink4Description: https://datasheet.ciiva.com/7660/1868787-7660790.pdf?src-supplier=Element14; ComponentLink5URL: https://datasheet.ciiva.com/7746/1738695-7746279.pdf?src-supplier=Element14; ComponentLink5Description: https://datasheet.ciiva.com/7746/1738695-7746279.pdf?src-supplier=Element14; ComponentLink6URL: https://datasheet.ciiva.com/7746/1686128-7746280.pdf?src-supplier=Element14; ComponentLink6Description: https://datasheet.ciiva.com/7746/1686128-7746280.pdf?src-supplier=Element14; ComponentLink7URL: https://datasheet.ciiva.com/7746/1738695-7746281.pdf?src-supplier=Element14; ComponentLink7Description: https://datasheet.ciiva.com/7746/1738695-7746281.pdf?src-supplier=Element14; ComponentLink8URL: https://datasheet.ciiva.com/7983/443971-7983613.pdf?src-supplier=Element14; ComponentLink8Description: https://datasheet.ciiva.com/7983/443971-7983613.pdf?src-supplier=Element14; ComponentLink9URL: https://datasheet.ciiva.com/15189/getdatasheetpartid-404327-15189644.pdf?src-supplier=Verical; ComponentLink9Description: https://datasheet.ciiva.com/15189/getdatasheetpartid-404327-15189644.pdf?src-supplier=Verical; Supplier Part Number 1: 4016291
U7 U8 = PCA9685PW,112: I2C LED Driver; Manufacturer: NXP Semiconductors; Package Body Material: Plastic; Data Input Mode: SERIAL; fmax-Min: 1MHz; Interface IC Type: LED DISPLAY DRIVER; Multiplexed Display Capability: No; Number of Functions: 1; Number of Segments: 16; Package Equivalence Code: TSSOP28,.25; Power Supplies: 2.5/5V; Max Supply Voltage: 5.5V; Min Supply Voltage: 2.3V; Supply Voltage-Nom: 3V; Time @ Peak Reflow Temperature-Max (s): 30s; Qualification Status: Not Qualified; Supplier 1: Newark; Manufacturer Part Number: PCA9685PW,112; RoHS: Yes; Category: LED Drivers; Stock 1: 13575; Pricing 1: 1=1.3, 10=1.3, 25=1.3, 50=1.3, 100=1.3, 250=1.29, 500=1.27 (USD); Package Code: TSSOP; Number of Pins: 28; Package Shape: Rectangular; Terminal Finish: Gold; Min Operating Temperature: -40°C; Max Operating Temperature: 85°C; JESD-609 Code: e4; JESD-30 Code: R-PDSO-G28; Moisture Sensitivity Level: 1; Package Style: SMALL OUTLINE, THIN PROFILE, SHRINK PITCHMeter; Peak Reflow Temperature (Cel): 260°C; Surface Mount: Yes; Terminal Form: Gull Wing; Terminal Position: DUAL; Length: 9.7mm; Width: 4.4mm; Height - Seated (Max): 1.1mm; Terminal Pitch: 0.65mm; Temperature Grade: INDUSTRIAL; Reach SVHC Compliant: Yes; RoHS Compliant: Yes; ComponentLink1URL: https://datasheet.ciiva.com:443/pdfs/VipMasterIC/IC/PHGL/PHGL-S-A0000775254/PHGL-S-A0000775254-1.pdf?src-supplier=IHS+Markit; ComponentLink1Description: https://datasheet.ciiva.com:443/pdfs/VipMasterIC/IC/PHGL/PHGL-S-A0000775254/PHGL-S-A0000775254-1.pdf?src-supplier=IHS+Markit; ComponentLink2URL: https://datasheet.ciiva.com/1945/pca9685-1945096.pdf?src-supplier=Digikey; ComponentLink2Description: https://datasheet.ciiva.com/1945/pca9685-1945096.pdf?src-supplier=Digikey; ComponentLink3URL: https://datasheet.ciiva.com/8125/pca9685-8125354.pdf?src-supplier=Avnet; ComponentLink3Description: https://datasheet.ciiva.com/8125/pca9685-8125354.pdf?src-supplier=Avnet; Supplier Part Number 1: 85AC2130